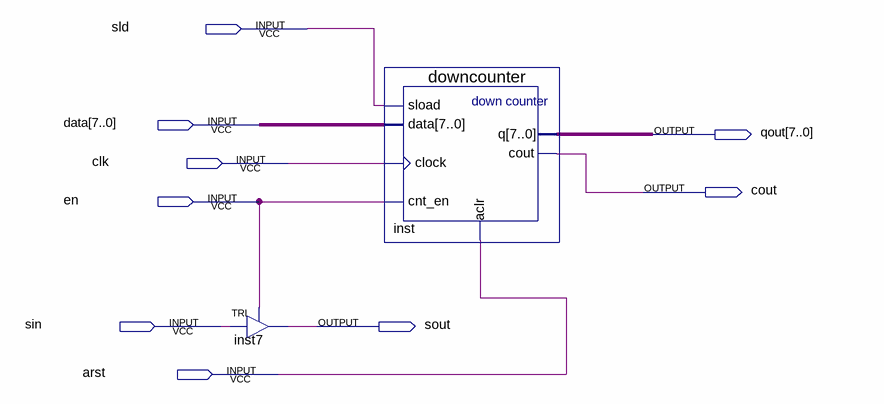
[diagram p0: schematic sheet]
// Quartus schematic counterdown.bdf as structural Verilog: 2 symbols, 9 pins
module counterdown (
  input  sld,
  input  [7:0] data,
  input  clk,
  input  en,
  input  sin,
  input  arst,
  output [7:0] qout,
  output cout,
  output sout
);

  TRI inst7 (.IN(sin), .OE(en), .OUT(sout));
  downcounter inst (.sload(sld), .data(data), .clock(clk), .cnt_en(en), .aclr(arst), .cout(cout), .q(qout));
endmodule
